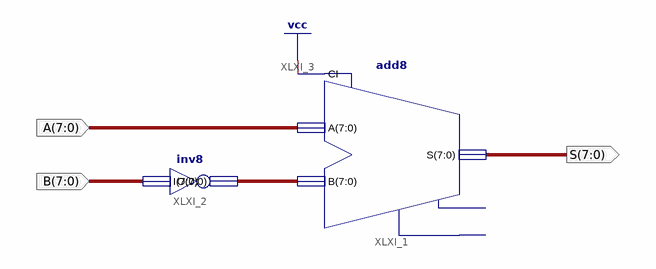
[diagram p0: schematic sheet 1]
// Xilinx ISE schematic SUB.sch (spartan6) as structural Verilog: 2 symbols, 3 ports
module SUB (
  input  [7:0] A,
  input  [7:0] B,
  output [7:0] S
);

  wire [7:0] XLXN_3;

  add8 XLXI_1 (.A(A), .B(XLXN_3), .CI(1'b1), .S(S));  // open: CO, OFL
  inv8 XLXI_2 (.I(B), .O(XLXN_3));
endmodule
